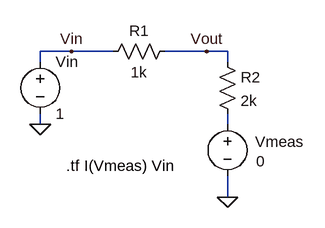
[diagram p0: schematic Fig1_12.asc]
Fig1_12.asc, the LTspice schematic file:
Version 4
SHEET 1 1048 680
WIRE 48 224 0 224
WIRE 112 224 48 224
WIRE 256 224 192 224
WIRE 288 224 256 224
WIRE 0 240 0 224
WIRE 288 240 288 224
WIRE 0 336 0 320
WIRE 288 336 288 320
WIRE 288 448 288 416
FLAG 0 336 0
FLAG 288 448 0
FLAG 256 224 Vout
FLAG 48 224 Vin
SYMBOL voltage 0 224 R0
WINDOW 123 0 0 Left 0
WINDOW 39 0 0 Left 0
SYMATTR InstName Vin
SYMATTR Value 1
SYMBOL res 96 240 R270
WINDOW 0 32 56 VTop 0
WINDOW 3 0 56 VBottom 0
SYMATTR InstName R1
SYMATTR Value 1k
SYMBOL res 272 224 R0
SYMATTR InstName R2
SYMATTR Value 2k
SYMBOL voltage 288 320 R0
WINDOW 0 43 43 Left 0
WINDOW 3 44 73 Left 0
SYMATTR InstName Vmeas
SYMATTR Value 0
TEXT 40 400 Left 0 !.tf I(Vmeas) Vin

The netlist it stands for:
* Fig1_12.asc
Vin Vin 0 1
R1 Vin Vout 1k
R2 Vout N001 2k
Vmeas N001 0 0
.tf I(Vmeas) Vin
.backanno
.end